# Altium schematic sheet [02]MCU.SchDoc
size B
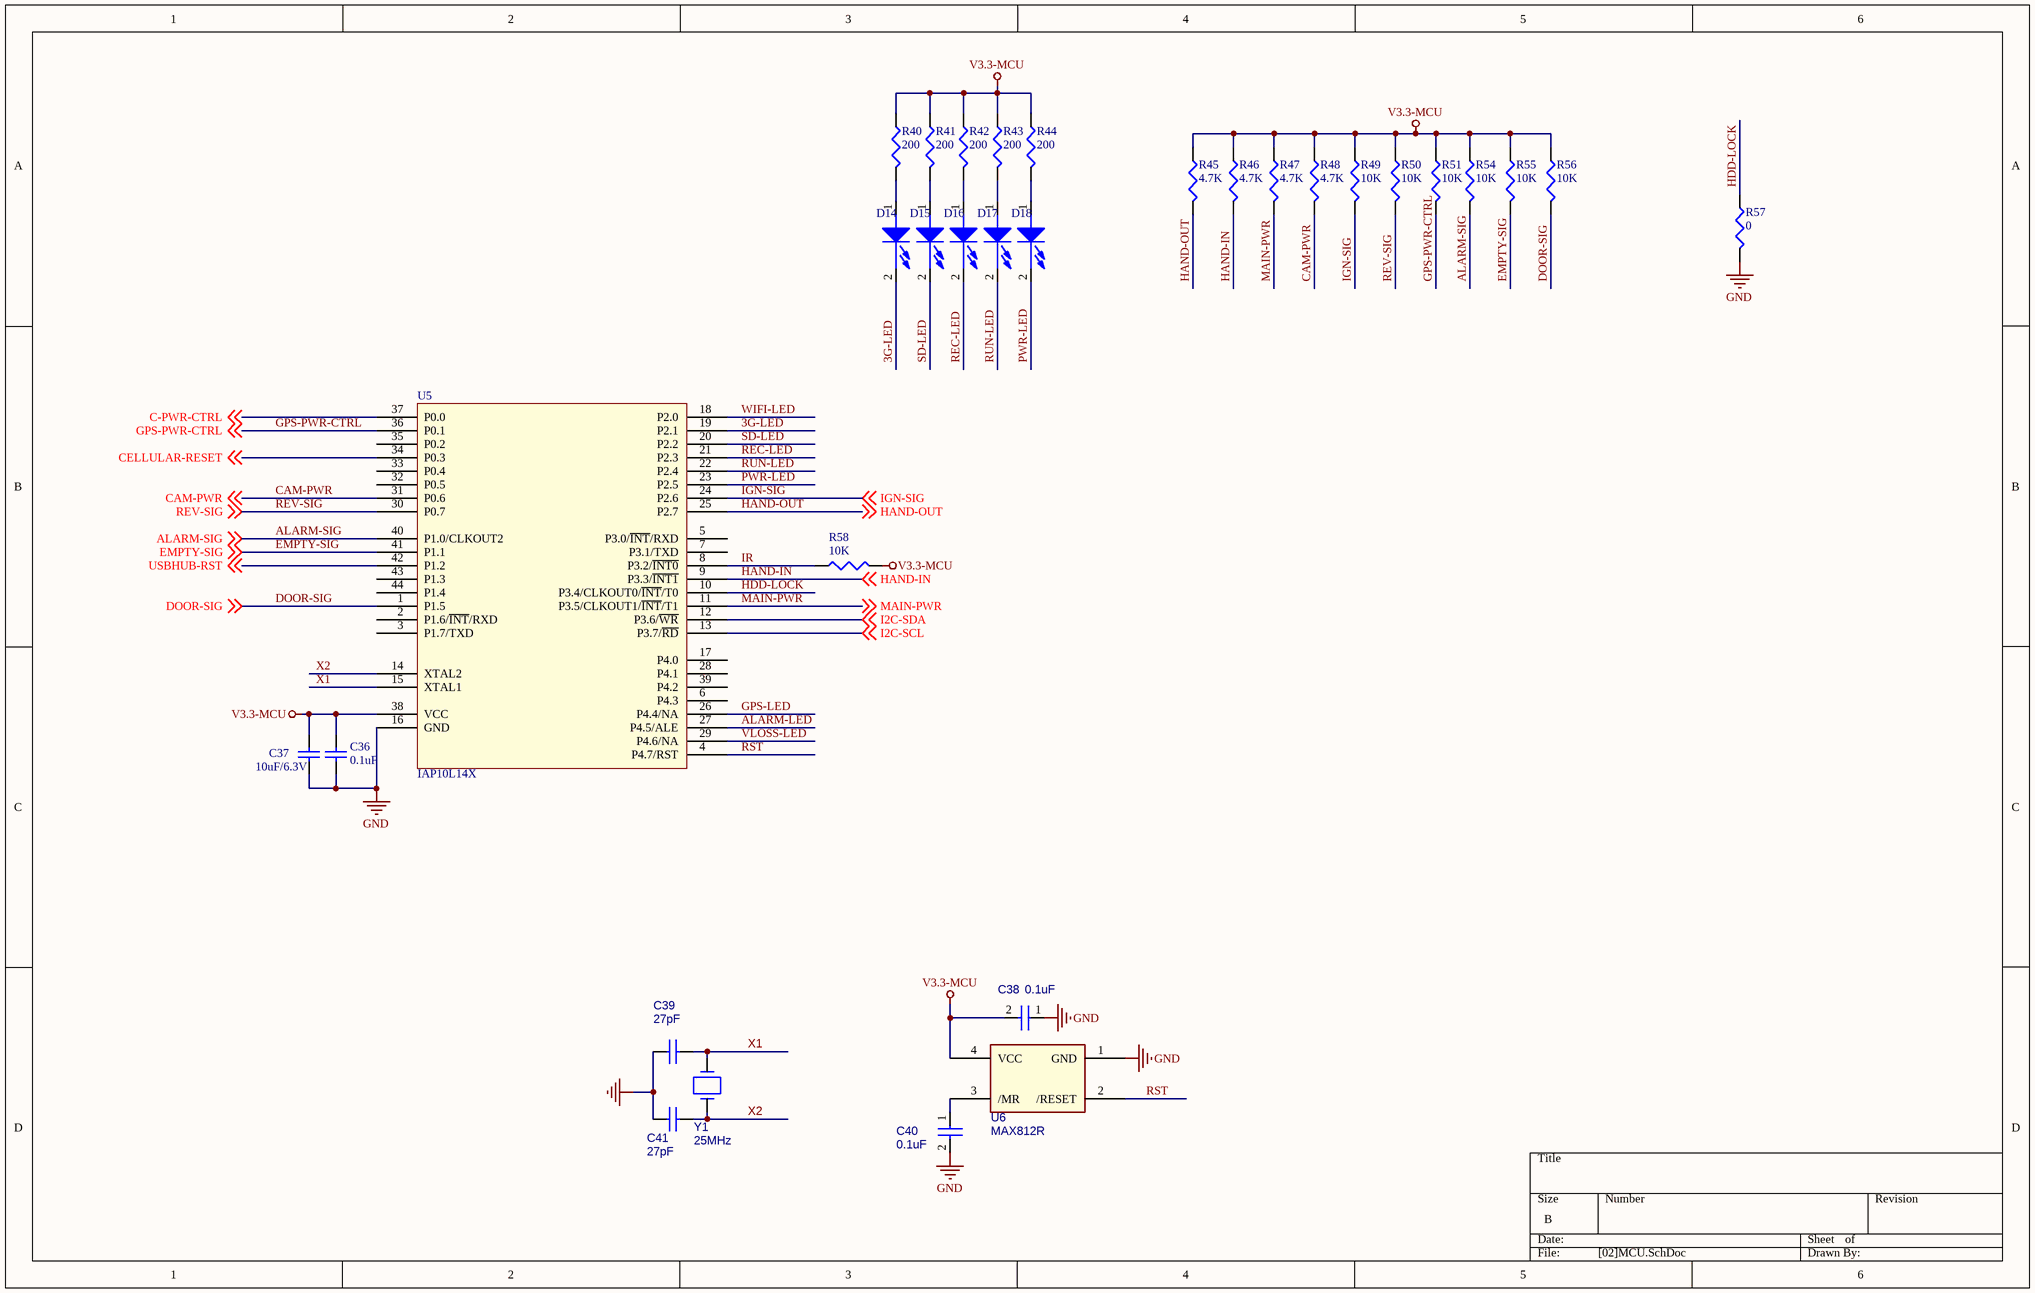
[diagram p0: [02]MCU.SchDoc]

## Parts
C36  0.1uF  [0603]
C37  10uF/6.3V  [0805]
C38  0.1uF  [0603]
C39  27pF  [0603]
C40  0.1uF  [0603]
C41  27pF  [0603]
D14  LED GREEN  [LED0603]  (value not drawn)
D15  LED GREEN  [LED0603]  (value not drawn)
D16  LED GREEN  [LED0603]  (value not drawn)
D17  LED GREEN  [LED0603]  (value not drawn)
D18  LED GREEN  [LED0603]  (value not drawn)
R40  200  [0603]
R41  200  [0603]
R42  200  [0603]
R43  200  [0603]
R44  200  [0603]
R45  4.7K  [0603]
R46  4.7K  [0603]
R47  4.7K  [0603]
R48  4.7K  [0603]
R49  10K  [0603]
R50  10K  [0603]
R51  10K  [0603]
R54  10K  [0603]
R55  10K  [0603]
R56  10K  [0603]
R57  0  [0603]
R58  10K  [0603]
U5  IAP10L14X  [LQFP44]
U6  MAX812R  [SOT143]
Y1  25MHz  [SMD-XTAL-5032]

## Nets
GND: C36.1 C37.1 C38.1 C39.1 C40.2 C41.1 R57.2 U5.16(GND) U6.1(GND)
V3.3-MCU: C36.2 C37.2 C38.2 R40.1 R41.1 R42.1 R43.1 R44.1 R45.1 R46.1 R47.1 R48.1 R49.1 R50.1 R51.1 R54.1 R55.1 R56.1 R58.2 U5.38(VCC) U6.4(VCC)
3G-LED: D14.2(CATHODE) U5.19(P2.1)
ALARM-LED: U5.27(P4.5/ALE)
ALARM-SIG: R54.2 U5.40(P1.0/CLKOUT2) ; off-sheet ALARM-SIG
C-PWR-CTRL: U5.37(P0.0) ; off-sheet C-PWR-CTRL
CAM-PWR: R48.2 U5.31(P0.6) ; off-sheet CAM-PWR
CELLULAR-RESET: U5.34(P0.3) ; off-sheet CELLULAR-RESET
DOOR-SIG: R56.2 U5.1(P1.5) ; off-sheet DOOR-SIG
EMPTY-SIG: R55.2 U5.41(P1.1) ; off-sheet EMPTY-SIG
GPS-LED: U5.26(P4.4/NA)
GPS-PWR-CTRL: R51.2 U5.36(P0.1) ; off-sheet GPS-PWR-CTRL
HAND-IN: R46.2 U5.9(P3.3/~{INT1}) ; off-sheet HAND-IN
HAND-OUT: R45.2 U5.25(P2.7) ; off-sheet HAND-OUT
HDD-LOCK: R57.1 U5.10(P3.4/CLKOUT0/~{INT}/T0)
I2C-SCL: U5.13(P3.7/~{RD}) ; off-sheet I2C-SCL
I2C-SDA: U5.12(P3.6/~{WR}) ; off-sheet I2C-SDA
IGN-SIG: R49.2 U5.24(P2.6) ; off-sheet IGN-SIG
IR: R58.1 U5.8(P3.2/~{INT0})
MAIN-PWR: R47.2 U5.11(P3.5/CLKOUT1/~{INT}/T1) ; off-sheet MAIN-PWR
PWR-LED: D18.2(CATHODE) U5.23(P2.5)
REC-LED: D16.2(CATHODE) U5.21(P2.3)
REV-SIG: R50.2 U5.30(P0.7) ; off-sheet REV-SIG
RST: U5.4(P4.7/RST) U6.2(/RESET)
RUN-LED: D17.2(CATHODE) U5.22(P2.4)
SD-LED: D15.2(CATHODE) U5.20(P2.2)
USBHUB-RST: U5.42(P1.2) ; off-sheet USBHUB-RST
VLOSS-LED: U5.29(P4.6/NA)
WIFI-LED: U5.18(P2.0)
X1: C39.2 U5.15(XTAL1) Y1.2
X2: C41.2 U5.14(XTAL2) Y1.1
NetC40_1: C40.1 U6.3(/MR)
NetD14_1: D14.1(ANODE) R40.2
NetD15_1: D15.1(ANODE) R41.2
NetD16_1: D16.1(ANODE) R42.2
NetD17_1: D17.1(ANODE) R43.2
NetD18_1: D18.1(ANODE) R44.2

Not connected (* = marked no-connect by the designer): U5 2(P1.6/~{INT}/RXD) 3(P1.7/TXD) 5(P3.0/~{INT}/RXD) 6(P4.3) 7(P3.1/TXD) 17(P4.0) 28(P4.1) 32(P0.5) 33(P0.4) 35(P0.2) 39(P4.2) 43(P1.3) 44(P1.4)

## Library data of the parts
C36 C37 = Cap: Capacitor
C38 C40 = CAP NP_Dup2
C39 C41 = CAP_Dup1
D14-D18 = LN01401_1
R40-R51 R54-R58 = CR16-1003FM
U6 = MAX811
Y1 = CRYSTAL